# EAGLE design v4_Controller_PCB (EAGLE 7.1.0)
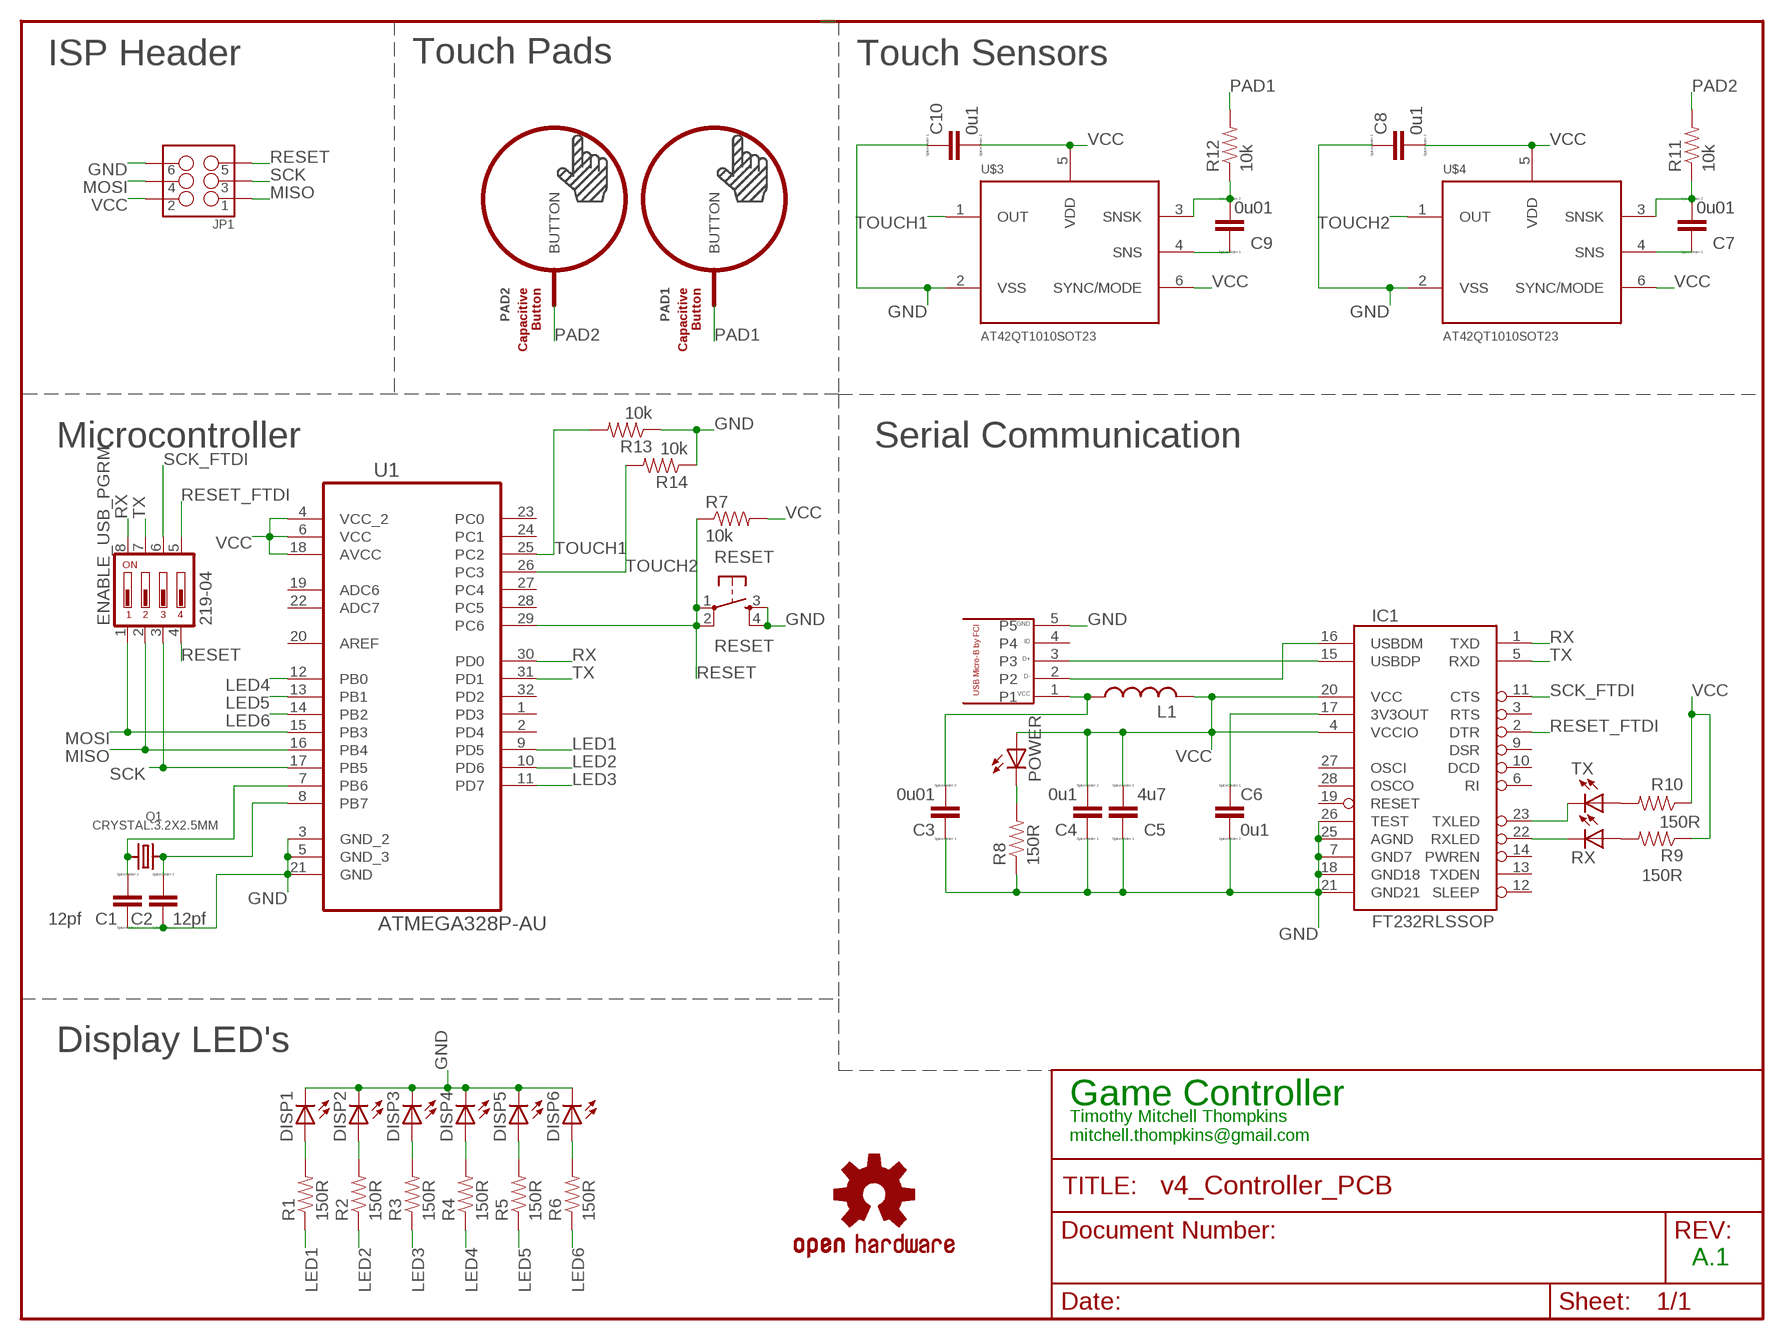
[diagram p0: schematic, sheet 1]

## Parts
BUTTON1  TOUCH_LOGO  [TOUCH_LOGO]
C1  12pf  CC0603  [C0603]
C2  12pf  CC0603  [C0603]
C3  0u01  CC0603  [C0603]
C4  0u1  CC0603  [C0603]
C5  4u7  CC0603  [C0603]
C6  0u1  CC0603  [C0603]
C7  0u01  CC0603  [C0603]
C8  0u1  CC0603  [C0603]
C9  0u01  CC0603  [C0603]
C10  0u1  CC0603  [C0603]
DISP1  LEDCHIPLED_0603  [CHIPLED_0603]
DISP2  LEDCHIPLED_0603  [CHIPLED_0603]
DISP3  LEDCHIPLED_0603  [CHIPLED_0603]
DISP4  LEDCHIPLED_0603  [CHIPLED_0603]
DISP5  LEDCHIPLED_0603  [CHIPLED_0603]
DISP6  LEDCHIPLED_0603  [CHIPLED_0603]
ENABLE_USB_PGRM  219-04  [CTS-219-04]
IC1  FT232RLSSOP  [SSOP28DB]
JP1  M03X2POGO_PINS  [2X3_POGO]
L1  L-USL2012C  [L2012C]
LOGO2  OSHW-LOGOS  [OSHW-LOGO-S]
PAD1  BUTTON_PASSIVE8MM  [BUTTON_PASSIVE_8MM]
PAD2  BUTTON_PASSIVE8MM  [BUTTON_PASSIVE_8MM]
POWER  LEDCHIPLED_0603  [CHIPLED_0603]
Q1  CRYSTAL.3.2X2.5MM  [3.2X2.5MM]
R1  150R  RESISTOR0603-RES  [0603-RES]
R2  150R  RESISTOR0603-RES  [0603-RES]
R3  150R  RESISTOR0603-RES  [0603-RES]
R4  150R  RESISTOR0603-RES  [0603-RES]
R5  150R  RESISTOR0603-RES  [0603-RES]
R6  150R  RESISTOR0603-RES  [0603-RES]
R7  10k  RESISTOR0603-RES  [0603-RES]
R8  150R  RESISTOR0603-RES  [0603-RES]
R9  150R  RESISTOR0603-RES  [0603-RES]
R10  150R  RESISTOR0603-RES  [0603-RES]
R11  10k  RESISTOR0603-RES  [0603-RES]
R12  10k  RESISTOR0603-RES  [0603-RES]
R13  10k  RESISTOR0603-RES  [0603-RES]
R14  10k  RESISTOR0603-RES  [0603-RES]
RESET  RESET  TAC_SWITCHPTH  [TACTILE-PTH]
RX  LEDCHIPLED_0603  [CHIPLED_0603]
TX  LEDCHIPLED_0603  [CHIPLED_0603]
U1  ATMEGA328P-AU  [QFP80P900X900X120-32N]
U$1  USB_MICRO_B_FCI  [10118194-0001LF]
U$3  AT42QT1010SOT23  [SOT23-6]
U$4  AT42QT1010SOT23  [SOT23-6]
U$6  TOUCH_LOGO  [TOUCH_LOGO]

## Nets
GND: C1.1 C2.1 C3.1 C4.1 C5.1 C6.2 C8.1 C10.1 DISP1.C DISP2.C DISP3.C DISP4.C DISP5.C DISP6.C IC1.7(GND7) IC1.18(GND18) IC1.21(GND21) IC1.25(AGND) IC1.26(TEST) JP1.P$6 R8.1 R13.1 R14.1 RESET.3 RESET.4 U1.3(GND_2) U1.5(GND_3) U1.21(GND) U$1.5 U$3.2(VSS) U$4.2(VSS)
LED1: R1.1 U1.9(PD5)
LED2: R2.1 U1.10(PD6)
LED3: R3.1 U1.11(PD7)
LED4: R4.1 U1.12(PB0)
LED5: R5.1 U1.13(PB1)
LED6: R6.1 U1.14(PB2)
MISO: ENABLE_USB_PGRM.2 JP1.P$1 U1.16(PB4)
MOSI: ENABLE_USB_PGRM.1 JP1.P$4 U1.15(PB3)
N$1: C9.2 R12.1 U$3.3(SNSK)
N$2: C3.2 L1.1 U$1.1
N$5: C2.2 Q1.3 U1.8(PB7)
N$6: C9.1 U$3.4(SNS)
N$7: POWER.C R8.2
N$8: C1.2 Q1.1 U1.7(PB6)
N$9: R10.2 TX.A
N$10: C6.1 IC1.17(3V3OUT)
N$11: R9.2 RX.A
N$12: IC1.16(USBDM) U$1.2
N$13: IC1.15(USBDP) U$1.3
N$14: IC1.23(TXLED) TX.C
N$15: IC1.22(RXLED) RX.C
N$19: C7.1 U$4.4(SNS)
N$22: C7.2 R11.1 U$4.3(SNSK)
N$24: DISP1.A R1.2
N$25: DISP2.A R2.2
N$26: DISP3.A R3.2
N$27: DISP4.A R4.2
N$28: DISP5.A R5.2
N$29: DISP6.A R6.2
PAD1: PAD1.P$1(BUTTON) R12.2
PAD2: PAD2.P$1(BUTTON) R11.2
RESET: ENABLE_USB_PGRM.4 JP1.P$5 R7.1 RESET.1 RESET.2 U1.29(PC6)
RESET_FTDI: ENABLE_USB_PGRM.5 IC1.2(DTR)
RX: ENABLE_USB_PGRM.8 IC1.1(TXD) U1.30(PD0)
SCK: ENABLE_USB_PGRM.3 JP1.P$3 U1.17(PB5)
SCK_FTDI: ENABLE_USB_PGRM.6 IC1.11(CTS)
TOUCH1: R13.2 U1.25(PC2) U$3.1(OUT)
TOUCH2: R14.2 U1.26(PC3) U$4.1(OUT)
TX: ENABLE_USB_PGRM.7 IC1.5(RXD) U1.31(PD1)
VCC: C4.2 C5.2 C8.2 C10.2 IC1.4(VCCIO) IC1.20(VCC) JP1.P$2 L1.2 POWER.A R7.2 R9.1 R10.1 U1.4(VCC_2) U1.6(VCC) U1.18(AVCC) U$3.5(VDD) U$3.6(SYNC/MODE) U$4.5(VDD) U$4.6(SYNC/MODE)
Unconnected: IC1.3(RTS) IC1.6(RI) IC1.9(DSR) IC1.10(DCD) IC1.12(SLEEP) IC1.13(TXDEN) IC1.14(PWREN) IC1.19(RESET) IC1.27(OSCI) IC1.28(OSCO) U1.1(PD3) U1.2(PD4) U1.19(ADC6) U1.20(AREF) U1.22(ADC7) U1.23(PC0) U1.24(PC1) U1.27(PC4) U1.28(PC5) U1.32(PD2) U$1.4

## Notes on the sheet
- ISP Header | Touch Pads | Touch Sensors
- Microcontroller | Serial Communication
- Display LED's
- Game Controller
- Timothy Mitchell Thompkins
  mitchell.thompkins@gmail.com
- A.1

## Power pins joined to a net without a drawn wire
GND: Q1.2(GND) Q1.4(GND) U$1.GND@1(GND) U$1.GND@2(GND) U$1.GND@3(GND) U$1.GND@4(GND)

## Library data of the parts
BUTTON1 U$6 = Touch_Logo:TOUCH_LOGO
C1-C10 = eagle-ltspice:C: CAPACITOR, European symbol; SPICEMODEL: NONE; SPICEPREFIX: C
DISP1-DISP6 POWER RX TX = adafruit:LED: LED OSRAM: - CHIPLED LG R971, LG N971, LY N971, LG Q971, LY Q971, LO R971, LY R971 LH N974, LH R974 LS Q976, LO Q976, LY Q976 LO Q996 - Hyper CHIPLED LW Q18S LB Q993, LB Q99A, LB R99A - SideLED LS A670, LO A670, LY A670, LG A670, LP A670 LB A673, LV A673, LT A673, LW A673 LH A674 LY A675 LS A676, LA A676, LO A676, LY A676, LW A676 LS A679, LY A679, LG A679 - Hyper Micro SIDELED® LS Y876, LA Y876, LO Y876, LY Y876 LT Y87S - SmartLED LW L88C, LW L88S LB L89C, LB L89S, LG L890 LS L89K, LO L89K, LY L89K LS L896, LA L896, LO L896, LY L896 - TOPLED LS T670, LO T670, LY T670, LG T670, LP T670 LSG T670, LSP T670, LSY T670, LOP T670, LYG T670 LG T671, LOG T671, LSG T671 LB T673, LV T673, LT T673, LW T673 LH T674 LS T676, LA T676, LO T676, LY T676, LB T676, LH T676, LSB T676, LW T676 LB T67C, LV T67C, LT T67C, LS T67K, LO T67K, LY T67K, LW E67C LS E67B, LA E67B, LO E67B, LY E67B, LB E67C, LV E67C, LT E67C LW T67C LS T679, LY T679, LG T679 LS T770, LO T770, LY T770, LG T770, LP T770 LB T773, LV T773, LT T773, LW T773 LH T774 LS E675, LA E675, LY E675, LS T675 LS T776, LA T776, LO T776, LY T776, LB T776 LHGB T686 LT T68C, LB T68C - Hyper Mini TOPLED® LB M676 - Mini TOPLED Santana® LG M470 LS M47K, LO M47K, LY M47K Source: http://www.osram.convergy.de/
ENABLE_USB_PGRM = switch-dil:219-04*: Surface Mount DIP Switch Series 219 SMT CTS Electronic Components Sourc: www.ctscorp.com; OC_FARNELL: unknown; OC_NEWARK: unknown
IC1 = SparkFun:FT232RL: USB UART FT232RL 4th Generation USB UART (USB <-> Serial) Controller. Spark Fun Electronics SKU : COM-00650
JP1 = SparkFun-Connectors:M03X2: 2x3 .1" header. Shrouded, with keying- CONN-10681 SMT- CONN-11415 Pogo pins- HW-11044; PROD_ID: HW-11044
L1 = rcl:L-US: INDUCTOR, American symbol
LOGO2 = SparkFun-Aesthetics:OSHW-LOGO: Open Source Hardware Logo This logo indicates the piece of hardware it is found on incorporates a OSHW license and/or adheres to the definition of open source hardware found here: http://freedomdefined.org/OSHW
PAD1 PAD2 = PatternAgents-TouchWidgets:BUTTON_PASSIVE: Button, Passive Capacitive/Touch Sensing Type Source : http://www.PatternAgents.com Github : https://github.com/PatternAgents License : http://creativecommons.org/licenses/by-sa/3.1/ (Creative Commons 3.1) THIS SOFTWARE IS PROVIDED BY THE CONTRIBUTORS "AS IS" AND WITHOUT ANY EXPRESS OR IMPLIED WARRANTIES, INCLUDING, BUT NOT LIMITED TO, THE IMPLIED WARRANTIES OF MERCHANTABILITY AND FITNESS FOR A PARTICULAR PURPOSE ARE DISCLAIMED. IN NO EVENT SHALL THE COPYRIGHT OWNER OR CONTRIBUTORS BE LIABLE FOR ANY DIRECT, INDIRECT, INCIDENTAL, SPECIAL, EXEMPLARY, OR CONSEQUENTIAL DAMAGES (INCLUDING, BUT NOT LIMITED TO, PROCUREMENT OF SUBSTITUTE GOODS OR SERVICES; LOSS OF USE, DATA, OR PROFITS; OR BUSINESS INTERRUPTION) HOWEVER CAUSED AND ON ANY THEORY OF LIABILITY, WHETHER IN CONTRACT, STRICT LIABILITY, OR TORT (INCLUDING NEGLIGENCE OR OTHERWISE) ARISING IN ANY WAY OUT OF THE USE OF THIS SOFTWARE, EVEN IF ADVISED OF THE POSSIBILITY OF SUCH DAMAGE.
Q1 = abracon:CRYSTAL
R1-R14 = SparkFun:RESISTOR: Resistor Basic schematic elements and footprints for 0603, 1206, and PTH resistors.
RESET = SparkFun:TAC_SWITCH: Momentary Switch Button commonly used for reset or general input. Spark Fun Electronics SKU : COM-00097
U1 = Atmel_By_element14_Batch_1-00:ATMEGA328P-AU: 8-bit Microcontroller with In-System Programmable Flash; MPN: ATMEGA328P-AU; OC_FARNELL: 1715486; OC_NEWARK: 14R4631; PACKAGE: TQFP-32; SUPPLIER: Atmel
U$1 = MicroUSB_B_10118194_0001LF:USB_MICRO_B_FCI
U$3 U$4 = SparkFun-DigitalIC:AT42QT1010

## Net classes
0 default: clearance 0.205 mm

## Board
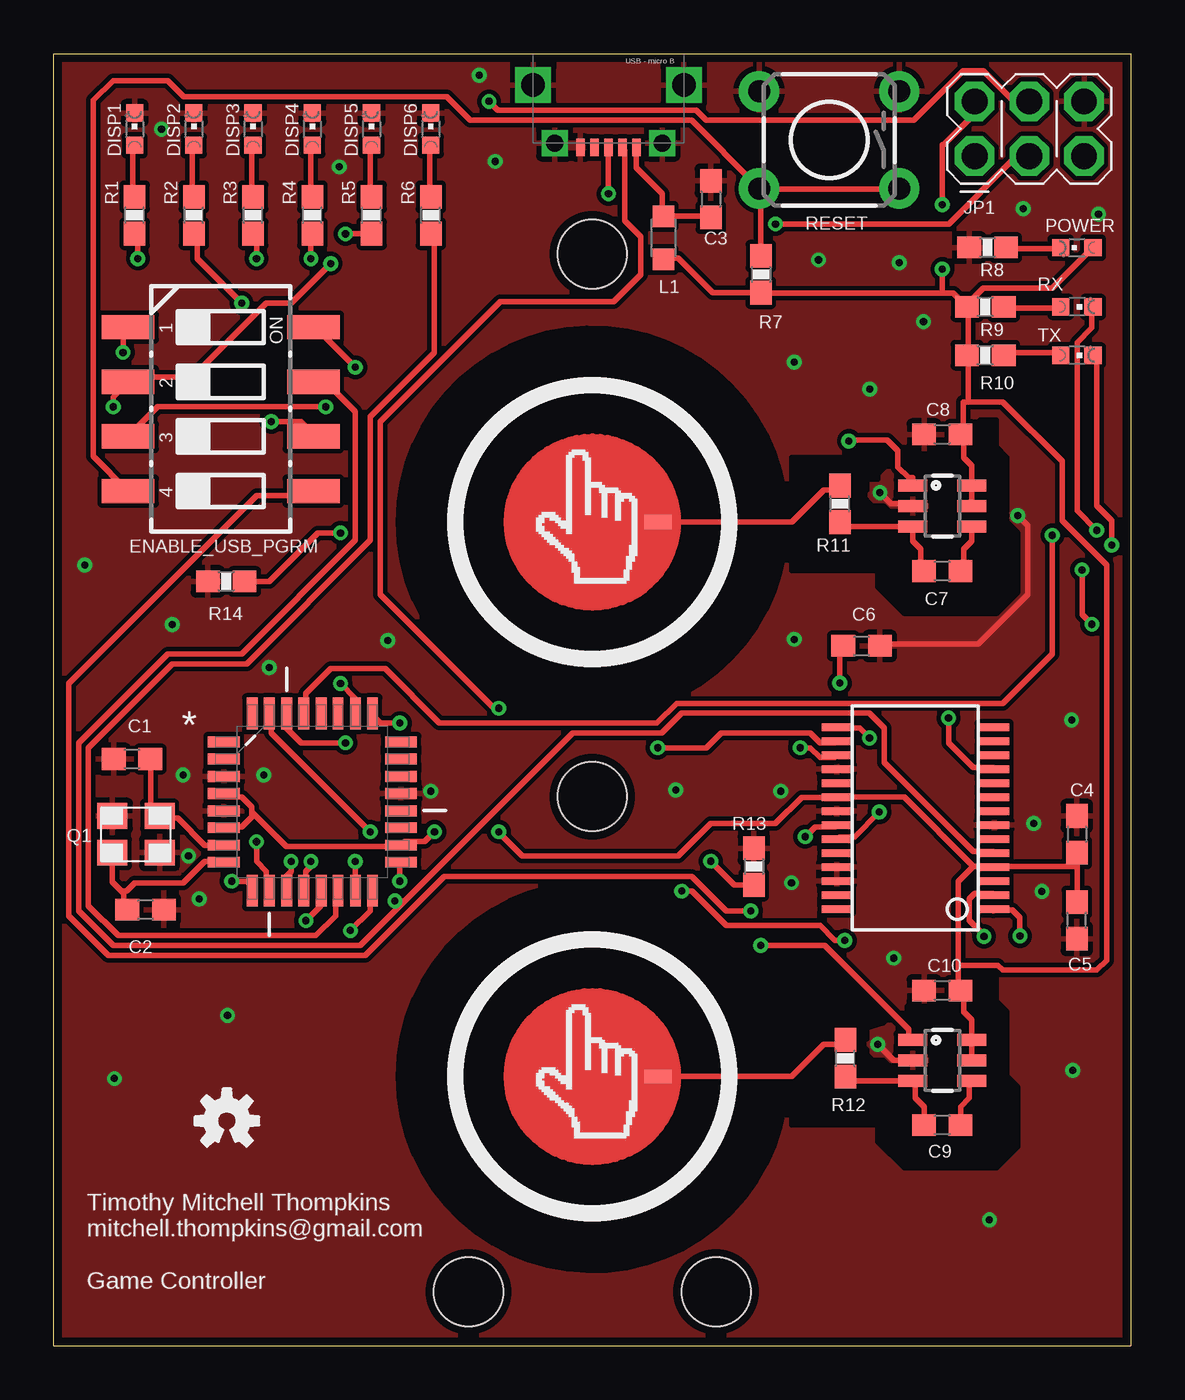
[diagram p1: board, top side]
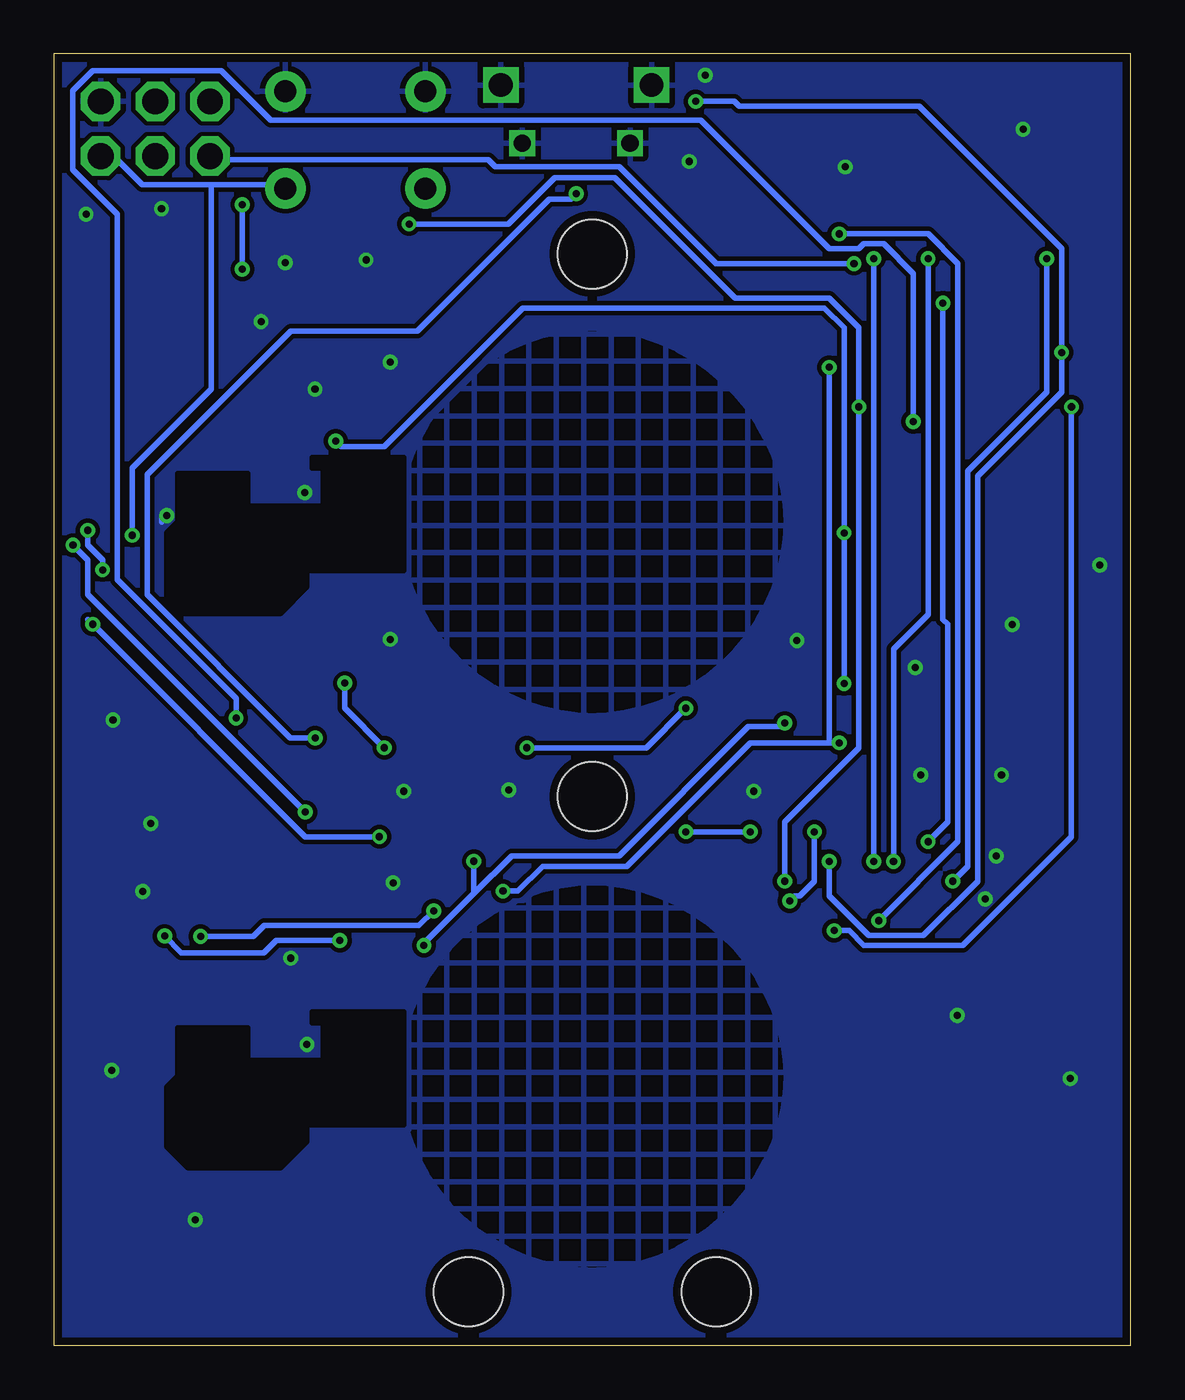
[diagram p2: board, bottom side, seen from below]

Size 50 x 60 mm. Coordinates in mm from the lower left corner, seen from the top.
Outline: 0,0 0,60 50,60 50,0 0,0
Copper layers (1*16): Top 0.0356mm / dielectric 1.5011mm / Bottom 0.0356mm
Design rules "oshpark *": minimum track width 10mil, minimum drill 13mil, track to track 8mil, track to pad 8mil, pad to pad 8mil, via to via 8mil, smd to smd 8mil, copper to edge 15mil, drill to drill 15mil, minimum pad ring 7mil, minimum via ring 7mil, stop-mask expansion 3mil, vias tented up to drill 0mil, thermal gap 10mil
Holes 3.2 mm at 19.25,2.5 30.75,2.5 25,50.7 25,25.5
tRestrict: area 34.2,13 to 35.5,15.5; area 40.5,11 to 42,14.5; area 42.8,12.8 to 44.2,17.2; area 35.8,14.5 to 38.2,15.5; area 37.5,12.8 to 39,13.5; area 40.5,36.8 to 42,40.2; area 42.8,38.5 to 44.2,43; area 39.6,40.4 to 42.2,41.4; area 39.6,14.7 to 42.2,15.7; area 34.2,8.2 to 44.8,12.5; area 37.5,14.2 to 38.8,15.2; area 37.5,13.8 to 37.8,14; 8 more areas; 2 lines
bRestrict: area 34.2,8.2 to 44.8,15.5; area 34.2,34 to 44.8,41.2; area 33.8,36 to 35.5,41.2; area 33.8,10.2 to 35.5,15.5
vRestrict: area 16,29.2 to 34,47.2; area 16,3.5 to 34,21.5

### Footprints (pad centres in the part's own frame; a part is rotated, then mirrored left to right if it is on the bottom)
C0603 = smd 1.1 x 1: 1 -0.85,0; 2 0.85,0
CHIPLED_0603 = smd 0.8 x 0.8: A 0,-0.75; C 0,0.75
CTS-219-04 = smd 1.13 x 2.44: 1 -3.81,-4.3; 2 -1.27,-4.3; 3 1.27,-4.3; 4 3.81,-4.3; 5 3.81,4.3; 6 1.27,4.3; 7 -1.27,4.3; 8 -3.81,4.3
SSOP28DB = smd 0.348 x 1.397: 1 -4.225,-3.656; 2 -3.575,-3.656; 3 -2.925,-3.656; 4 -2.275,-3.656; 5 -1.625,-3.656; 6 -0.975,-3.656; 7 -0.325,-3.656; 8 0.325,-3.656; 9 0.975,-3.656; 10 1.625,-3.656; 11 2.275,-3.656; 12 2.925,-3.656; 13 3.575,-3.656; 14 4.225,-3.656; 15 4.225,3.656; 16 3.575,3.656; 17 2.925,3.656; 18 2.275,3.656; 19 1.625,3.656; 20 0.975,3.656; 21 0.325,3.656; 22 -0.325,3.656; 23 -0.975,3.656; 24 -1.625,3.656; 25 -2.275,3.656; 26 -2.925,3.656; 27 -3.575,3.656; 28 -4.225,3.656
2X3_POGO = drill 1.2 pad 1.829 octagon: P$1 0,0; P$2 0,2.54; P$3 2.54,0; P$4 2.54,2.54; P$5 5.08,0; P$6 5.08,2.54
L2012C = smd 1 x 1: 1 -1,0; 2 1,0
BUTTON_PASSIVE_8MM = smd 0.635 x 1.27: P$1 0,3.048
3.2X2.5MM = smd 1.4 x 1.2: 1 -1.1,-0.85; 2 1.1,-0.85; 3 1.1,0.85; 4 -1.1,0.85
0603-RES = smd 1.1 x 1: 1 -0.85,0; 2 0.85,0
TACTILE-PTH = drill 1.016 pad 1.88: 1 -3.251,2.261; 2 3.251,2.261; 3 -3.251,-2.261; 4 3.251,-2.261
QFP80P900X900X120-32N = smd 1.473 x 0.508: 1 -4.115,2.794; 2 -4.115,2.007; 3 -4.115,1.194; 4 -4.115,0.406; 5 -4.115,-0.406; 6 -4.115,-1.194; 7 -4.115,-2.007; 8 -4.115,-2.794; 17 4.115,-2.794; 18 4.115,-2.007; 19 4.115,-1.194; 20 4.115,-0.406; 21 4.115,0.406; 22 4.115,1.194; 23 4.115,2.007; 24 4.115,2.794 | smd 0.508 x 1.473: 9 -2.794,-4.115; 10 -2.007,-4.115; 11 -1.194,-4.115; 12 -0.406,-4.115; 13 0.406,-4.115; 14 1.194,-4.115; 15 2.007,-4.115; 16 2.794,-4.115; 25 2.794,4.115; 26 2.007,4.115; 27 1.194,4.115; 28 0.406,4.115; 29 -0.406,4.115; 30 -1.194,4.115; 31 -2.007,4.115; 32 -2.794,4.115
10118194-0001LF = smd 0.406 x 0.813: 1 -1.3,2.7; 2 -0.65,2.7; 3 0,2.7; 4 0.65,2.7; 5 1.3,2.7 | drill 1.1 pad 1.422 square: GND@1 -3.5,-0.2; GND@4 3.5,-0.2 | drill 0.8 pad 1.016 square: GND@2 -2.5,2.5; GND@3 2.5,2.5
SOT23-6 = smd 0.55 x 1.35: 1 -0.95,-1.375; 2 0,-1.375; 3 0.95,-1.375; 4 0.95,1.375; 5 0,1.375; 6 -0.95,1.375

### Placement (x,y rotation side)
BUTTON1  25.25,37.5 0 top
C1  3.63,27.25 0 top
C2  4.26,20.25 180 top
C3  30.5,53.25 270 top
C4  47.5,23.75 270 top
C5  47.5,19.75 90 top
C6  37.5,32.5 0 top
C7  41.25,35.98 180 top
C8  41.25,42.32 0 top
C9  41.25,10.25 180 top
C10  41.25,16.5 0 top
DISP1  3.75,56.5 0 top
DISP2  6.5,56.5 0 top
DISP3  9.25,56.5 0 top
DISP4  12,56.5 0 top
DISP5  14.75,56.5 0 top
DISP6  17.5,56.5 0 top
ENABLE_USB_PGRM  7.75,43.5 270 top
IC1  40,24.5 90 top
JP1  42.75,55.25 0 top
L1  28.3,51.45 270 top
LOGO2  8.03,10.44 0 top
PAD1  25,12.5 270 top
PAD2  25,38.25 270 top
POWER  47.5,51 90 top
Q1  3.81,23.75 180 top
R1  3.75,52.5 90 top
R2  6.5,52.5 90 top
R3  9.25,52.5 90 top
R4  12,52.5 90 top
R5  14.75,52.5 90 top
R6  17.5,52.5 90 top
R7  32.83,49.76 270 top
R8  43.35,51 0 top
R9  43.25,48.25 0 top
R10  43.25,46 0 top
R11  36.5,39.1 90 top
R12  36.75,13.35 90 top
R13  32.5,22.25 270 top
R14  8,35.5 0 top
RESET  36,56 180 top
RX  47.5,48.25 270 top
TX  47.5,46 270 top
U1  12,25.25 0 top
U$1  25.75,58.35 180 top
U$3  41.25,13.25 270 top
U$4  41.25,39 270 top
U$6  25.25,11.72 0 top

### Tracks (layer width: path | path; a pad name or v marks a point on that pad's centre or on a via)
GND  (via drill 0.33, 0.33 pad 0.25, 0.33 pad 0.33)
  Top 0.254: U$3.2 39,13.25 v38.25,14 | U$4.2 39.76,39.12 38.86,39.12 v38.35,39.62 | v44.75,38.56 45.21,38.1 45.21,34.88 42.92,32.59 38.56,32.59 C6.2 | 36.26,21.57 IC1.26 36.26,21.57
  Bottom 0.254: 44.98,38.25 44.98,38.56 v44.75,38.56 44.75,38.33
  other vias: 17.5,25.75 6,26.5 45.5,24.25 39,18 34.25,21.5 33.75,25.75 6.75,20.75 6.25,22.75 45.88,21.09 45,52.81 39.25,50.31 48.5,52.56 37.88,44.43 5.5,33.5 9.75,26.5 10,31.5 15.5,32.75 19.75,59 20.5,55 1.44,36.25 5,56.5 13.25,54.75 40.38,47.56 34.38,45.68 35.5,50.43 28.88,25.81 34.38,32.81 47.25,29.06 47.31,12.78 8.06,15.34 2.81,12.41 43.44,5.84
  pour Bottom (hatched): 16,12.5 arc-90 25,21.5 arc-90 34,12.5 arc-90 25,3.5 arc-90
  pour Bottom: 0,0 50,0 50,12.5 34,12.5 arc-90 25,3.5 arc-90 16,12.5 0,12.5
  pour Bottom (hatched): 16,38.25 arc-90 25,47.25 arc-90 34,38.25 arc-90 25,29.25 arc-90
  pour Bottom: 0,12.5 16,12.5 arc-90 25,21.5 arc-90 34,12.5 50,12.5 50,38.25 34,38.25 arc-90 25,29.25 arc-90 16,38.25 0,38.25
  pour Bottom: 0,38.25 16,38.25 arc-90 25,47.25 arc-90 34,38.25 50,38.25 50,60 0,60
  pour Top: 0,0 50,0 50,60 0,60
LED1  (via drill 0.33)
  Top 0.254: v3.9,50.49 3.9,51.64 R1.1 | v8.26,21.57 8.95,21.57 9.18,21.34 U1.9
  Bottom 0.254: v3.9,50.49 3.9,44.29 7.57,40.62 7.57,22.26 v8.26,21.57
LED2  (via drill 0.33)
  Top 0.254: v8.72,48.42 6.66,50.49 6.66,51.64 R2.1 | v9.41,23.41 9.41,22.49 9.87,22.03 9.87,21.34 U1.10
  Bottom 0.254: v8.72,48.42 8.72,33.74 8.49,33.51 8.49,24.33 v9.41,23.41
LED3  (via drill 0.33)
  Top 0.254: v9.41,50.49 9.41,51.64 R3.1 | v11.02,22.49 11.02,22.03 10.79,21.8 10.79,21.34 U1.11
  Bottom 0.254: v9.41,50.49 9.41,33.97 11.02,32.36 v11.02,22.49
LED4  (via drill 0.33)
  Top 0.254: v11.93,50.49 11.93,51.64 R4.1 | v11.93,22.49 11.93,22.26 11.7,22.03 11.7,21.34 U1.12
  Bottom 0.254: v11.93,22.49 v11.93,50.49
LED5  (via drill 0.33)
  Top 0.254: v13.54,51.64 14.69,51.64 R5.1 | v11.7,19.74 12.39,20.43 12.39,21.11 U1.13
  Bottom 0.254: v13.54,51.64 9.41,51.64 8.03,50.26 8.03,23.41 v11.7,19.74
LED6
  Top 0.254: R6.1 17.67,51.64 17.67,46.13 14.69,43.15 14.69,37.41 8.95,31.67 5.51,31.67 1.61,27.77 1.61,20.43 2.98,19.05 12.16,19.05 13.08,19.97 13.08,21.11 U1.14
MISO  (via drill 0.33)
  Top 0.254: v13.77,19.28 14.69,20.2 14.69,21.11 U1.16 | v2.75,43.6 2.75,44.06 3.44,44.75 ENABLE_USB_PGRM.2 3.67,44.98 6.43,44.98 9.87,48.42 11.02,48.42 v12.85,50.26
  Bottom 0.254: v13.77,19.28 13.08,19.28 12.39,18.59 7.8,18.59 2.75,23.64 v2.75,43.6 | v12.85,50.26 19.25,50.26 | 19.25,50.26 19.28,50.26 | JP1.P$1 42.69,55.08 29.83,55.08 29.5,54.75 23.74,54.75 19.25,50.26
MOSI  (via drill 0.33)
  Top 0.254: v14,22.49 14,21.34 U1.15 | v3.21,46.13 3.21,47.05 3.44,47.28 ENABLE_USB_PGRM.1 | JP1.P$4 45.21,57.83 44.52,57.83 43.15,59.21 42.23,59.21 39.93,56.92 30.29,56.92 29.84,57.38 20.62,57.38 v20.2,57.79
  Bottom 0.254: v14,22.49 14,20.88 12.16,19.05 9.64,19.05 7.11,21.57 7.11,40.39 3.21,44.29 v3.21,46.13 3.21,50.95 9.83,57.56 18.19,57.56 18.42,57.79 v20.2,57.79
N$1
  Top 0.254: R12.1 36.95,12.3 U$3.3 40,12.18 40,11.5 40.4,11.1 C9.2
N$2
  Top 0.254: U$1.1 27.05,54.7 28.25,53.5 28.25,52.5 L1.1 30.45,52.45 C3.2
N$5
  Top 0.254: C2.2 3.25,20.41 3.25,21 3.12,21.12 | 3.12,21.12 2.71,21.54 Q1.3 | U1.8 7.84,22.5 7,22.5 6,21.5 3.75,21.5 3.38,21.12 3.12,21.12
N$6
  Top 0.254: C9.1 42.1,11.1 42.5,11.5 42.5,12.18 U$3.4
N$7
  Top 0.254: POWER.C 46.59,50.95 44.29,50.95 R8.2
N$8
  Top 0.254: U1.7 7.01,23.24 5.75,24.5 5.01,24.5 Q1.1 4.5,25 4.5,27.23 C1.2
N$9
  Top 0.254: TX.A 46.59,46.13 44.29,46.13 R10.2
N$10  (via drill 0.33)
  Top 0.254: v36.49,30.77 36.49,32.36 C6.1 | v34.65,27.77 35.11,27.77 35.57,27.31 36.26,27.31 IC1.17
  Bottom 0.254: v36.49,30.77 36.49,29.61 v34.65,27.77
N$11
  Top 0.254: RX.A 46.59,48.2 44.29,48.2 R9.2
N$12  (via drill 0.33)
  Top 0.254: v20.66,29.61 20.43,29.61 15.15,34.88 15.15,42.92 20.73,48.5 26,48.5 27.25,49.75 27.25,51.5 26.5,52.25 26.5,55.5 U$1.2 26.39,55.54 26.38,55.54 26.38,55.62 | v28.04,27.77 30.29,27.77 30.98,28.46 35.11,28.46 35.57,28 36.26,28 IC1.16
  Bottom 0.254: v28.04,27.77 22.49,27.77 v20.66,29.61
N$13  (via drill 0.33)
  Top 0.254: v37.87,28.23 37.41,28.69 36.49,28.69 IC1.15 | 25.7,55.54 U$1.3 v25.75,53.5
  Bottom 0.254: v37.87,28.23 39.02,28.23 45.67,34.88 45.67,40.45 39,47.12 33.12,47.12 27,53.25 26,53.25 v25.75,53.5
N$14  (via drill 0.33)
  Top 0.254: v38.33,24.79 37.18,23.64 36.49,23.64 IC1.23 | v49.11,37.18 49.11,38.33 48.42,39.02 48.42,45.9 TX.C
  Bottom 0.254: v38.33,24.79 48.42,34.88 48.42,36.49 v49.11,37.18
N$15  (via drill 0.33)
  Top 0.254: v34.88,23.64 35.34,24.1 36.26,24.1 IC1.22 | v48.42,37.87 47.51,38.78 47.51,46.59 48.2,47.28 48.2,48.2 RX.C | v47.74,36.03 47.74,33.97 v48.2,33.51
  Bottom 0.254: 48.42,33.74 v48.2,33.51 38.33,23.64 v34.88,23.64 | v48.42,37.87 48.42,37.18 47.74,36.49 v47.74,36.03
N$19
  Top 0.254: C7.1 42.25,36.13 42.25,37 42.62,37.38 U$4.4
N$22
  Top 0.254: R11.1 36.7,38.05 U$4.3 39.88,37.38 40.25,37 40.25,36.13 C7.2
N$24
  Top 0.254: DISP1.A 3.67,55.54 3.67,53.47 R1.2
N$25
  Top 0.254: DISP2.A 6.43,55.54 6.43,53.47 R2.2
N$26
  Top 0.254: DISP3.A 9.18,55.54 9.18,53.47 R3.2
N$27
  Top 0.254: DISP4.A 11.93,55.54 11.93,53.47 R4.2
N$28
  Top 0.254: DISP5.A 14.69,55.54 14.69,53.47 R5.2
N$29
  Top 0.254: DISP6.A 17.44,55.54 17.44,53.47 R6.2
PAD1
  Top 0.254: PAD1.P$1 34.25,12.5 35.75,14 36.55,14 R12.2
PAD2
  Top 0.254: PAD2.P$1 34.25,38.25 35.75,39.75 36.3,39.75 R11.2
RESET  (via drill 0.33)
  Top 0.254: U1.29 11.7,29.38 11.7,30.29 12.85,31.44 15.38,31.44 17.9,28.92 28,28.92 28.92,29.84 44.06,29.84 46.36,32.13 v46.36,37.64 | 32.82,53.7 32.82,50.72 R7.1 | 32.82,53.7 39.24,53.7 RESET.1 | 32.82,53.7 RESET.2 32.59,53.93 29.61,56.92 19.33,56.92 18.25,58 6.03,58 5.28,58.75 2.75,58.75 1.84,57.84 1.84,41.31 3.44,39.7 ENABLE_USB_PGRM.4
  Bottom 0.254: v46.36,37.64 46.36,40.77 42.69,44.44 42.69,53.93 | 42.69,53.93 39.47,53.93 RESET.1 | 42.69,53.93 45.9,53.93 47.05,55.08 47.74,55.08 JP1.P$5
RESET_FTDI  (via drill 0.33)
  Top 0.254: v32.36,20.2 31.21,20.2 29.61,21.8 18.13,21.8 14.46,18.13 2.52,18.13 0.69,19.97 0.69,30.75 9.41,39.47 11.93,39.47 ENABLE_USB_PGRM.5 | IC1.2 43.58,21 42.75,21 42.5,20.75 42.5,19.75 43.19,19.06 v43.19,19.01
  Bottom 0.254: v32.36,20.2 33.05,19.51 40.24,19.51 40.75,19 v43.18,19 v43.19,19.01
RX  (via drill 0.33)
  Top 0.254: v36.72,18.82 36.26,18.82 35.57,19.51 31.21,19.51 29.61,21.11 v29.15,21.11 | v13.54,28 11.47,28 10.79,28.69 10.79,29.15 U1.30 | IC1.1 43.6,20.2 43.66,20.25 44.5,20.25 44.85,19.89 v44.85,19.03 | v14,45.44 12.16,47.28 ENABLE_USB_PGRM.8
  Bottom 0.254: v29.15,21.11 28.46,21.11 27.31,22.26 23.41,22.26 17.67,28 14,28 | v13.54,28 14,28 | 14,28 v14,45.44 | v44.85,19.03 44.08,18.25 40.25,18.25 39.68,18.82 v36.72,18.82
SCK  (via drill 0.33)
  Top 0.254: v16.07,21.57 16.07,22.26 U1.17 | v12.62,43.6 4.82,43.6 3.67,42.46 ENABLE_USB_PGRM.3 | v33.51,52.1 41.54,52.1 44.52,55.08 45.21,55.08 JP1.P$3
  Bottom 0.254: v16.07,21.57 16.07,24.33 12.62,27.77 v12.62,43.6 12.62,47.28 14,48.65 18.36,48.65 23.96,54.25 26.75,54.25 28.9,52.1 v33.51,52.1
SCK_FTDI  (via drill 0.33)
  Top 0.254: v41.54,29.15 41.54,28 42.69,26.85 43.6,26.85 IC1.11 | v10.1,42.92 11.47,42.92 11.93,42.46 ENABLE_USB_PGRM.6
  Bottom 0.254: v41.54,29.15 41.54,30.06 47.05,35.57 47.05,52.56 49.11,54.62 49.11,58.29 48.2,59.21 42.23,59.21 39.93,56.92 19.97,56.92 14,50.95 12.62,50.95 12.39,51.18 11.47,51.18 10.1,49.8 v10.1,42.92
TOUCH1  (via drill 0.33)
  Top 0.254: v32.82,18.59 35.8,18.59 39.7,14.69 39.7,14.23 U$3.1 | v16.07,28.92 15.15,28.92 14.92,29.15 U1.25 | R13.2 31.6,21.4 v30.5,22.5
  Bottom 0.254: v32.82,18.59 32.82,18.68 30.5,21 | 30.5,21 28.75,22.75 23.75,22.75 17.75,28.75 16.23,28.75 v16.07,28.92 | v30.5,22.5 30.5,21
TOUCH2  (via drill 0.33)
  Top 0.254: v13.31,30.75 14,30.06 14,29.38 U1.26 | v13.31,37.75 12.25,37.75 10,35.5 R14.2 | U$4.1 39.88,40.31 | 39.88,40.31 | 39.88,40.31 39.69,40.31 39.19,40.81 39.19,41.56 38.69,42.06 36.95,42.06 v36.91,42.02
  Bottom 0.254: v13.31,30.75 v13.31,37.75 13.31,47.28 14.23,48.2 28.23,48.2 34.65,41.77 36.66,41.77 v36.91,42.02
TX  (via drill 0.33)
  Top 0.254: 16.29,20.66 24.1,28.46 28.23,28.46 29.15,29.38 37.87,29.38 38.56,28.69 38.56,27.08 42.69,22.95 43.6,22.95 IC1.5 | v15.84,20.66 16.29,20.66 | v14.69,23.87 10.1,28.46 10.1,29.15 U1.31 | 16.29,20.66 14.23,18.59 2.75,18.59 1.15,20.2 1.15,28 5.28,32.13 8.72,32.13 14,37.41 14,43.38 12.62,44.75 12.16,44.75 ENABLE_USB_PGRM.7
  Bottom 0.254: v15.84,20.66 15.61,20.88 15.38,20.88 14.69,21.57 v14.69,23.87
VCC  (via drill 0.33)
  Top 0.254: C8.2 42.25,42.17 42.25,41.25 42.62,40.88 U$4.6 U$4.5 | C10.2 42.25,16.35 42.25,15.5 42.62,15.12 U$3.6 U$3.5 | 42,42.46 C8.2 | 42.23,16.52 C10.2 | C8.2 42.23,42.46 42.23,43.83 42.46,43.83 | 9.18,24.79 9.18,25.02 8.72,25.47 8.03,25.47 U1.4 | 9.18,24.79 9.18,24.56 8.72,24.1 8.03,24.1 U1.6 | 9.18,24.79 10.79,23.18 16.07,23.18 U1.18 16.29,23.41 17.21,23.41 v17.67,23.87 | 47.51,22.26 47.51,22.72 C4.2 | 47.51,22.26 47.51,20.66 C5.2 | 47.51,22.26 43.83,22.26 IC1.4 43.6,22.26 42.69,22.26 | 42.69,22.26 39.47,25.47 36.49,25.47 IC1.20 36.26,25.47 34.72,25.47 33.5,24.25 30.5,24.25 29,22.75 21.75,22.75 20.66,23.84 v20.66,23.87 | 42,17.67 42,21.57 42.69,22.26 | 42,17.67 42,16.52 C10.2 | 42.46,43.83 44.06,43.83 46.82,41.08 46.82,38.33 48.88,36.26 48.88,17.9 48.42,17.44 44.06,17.44 43.83,17.67 42,17.67 | POWER.A 48.2,50.95 46.36,49.11 43.15,49.11 42.46,48.42 R9.1 | R9.1 42.46,48.2 42.46,46.13 R10.1 42.46,45.9 42.46,43.83 | 41.25,48.88 41.77,48.88 42.23,48.42 R9.1 | 41.25,48.88 33.05,48.88 R7.2 30.59,48.91 29,50.5 28.35,50.5 L1.2 | JP1.P$2 42.69,57.6 42.69,57.15 41.31,55.77 41.25,55.77 v41.25,53 | v41.25,50 41.25,48.88
  Bottom 0.254: v20.66,23.87 v17.67,23.87 | v41.25,53 v41.25,50

### Text on the board
tPlace: Timothy Mitchell Thompkins / mitchell.thompkins@gmail.com / / Game Controller | /Users/TimothyThompkins/Projects/Interactive Game/Eagle_Files/Controller PCB/v2_Controller_PCB/Touch_Logo.bmp